# Altium schematic sheet Sheet4.SchDoc
size A; SheetNumber: 2; SheetTotal: 4
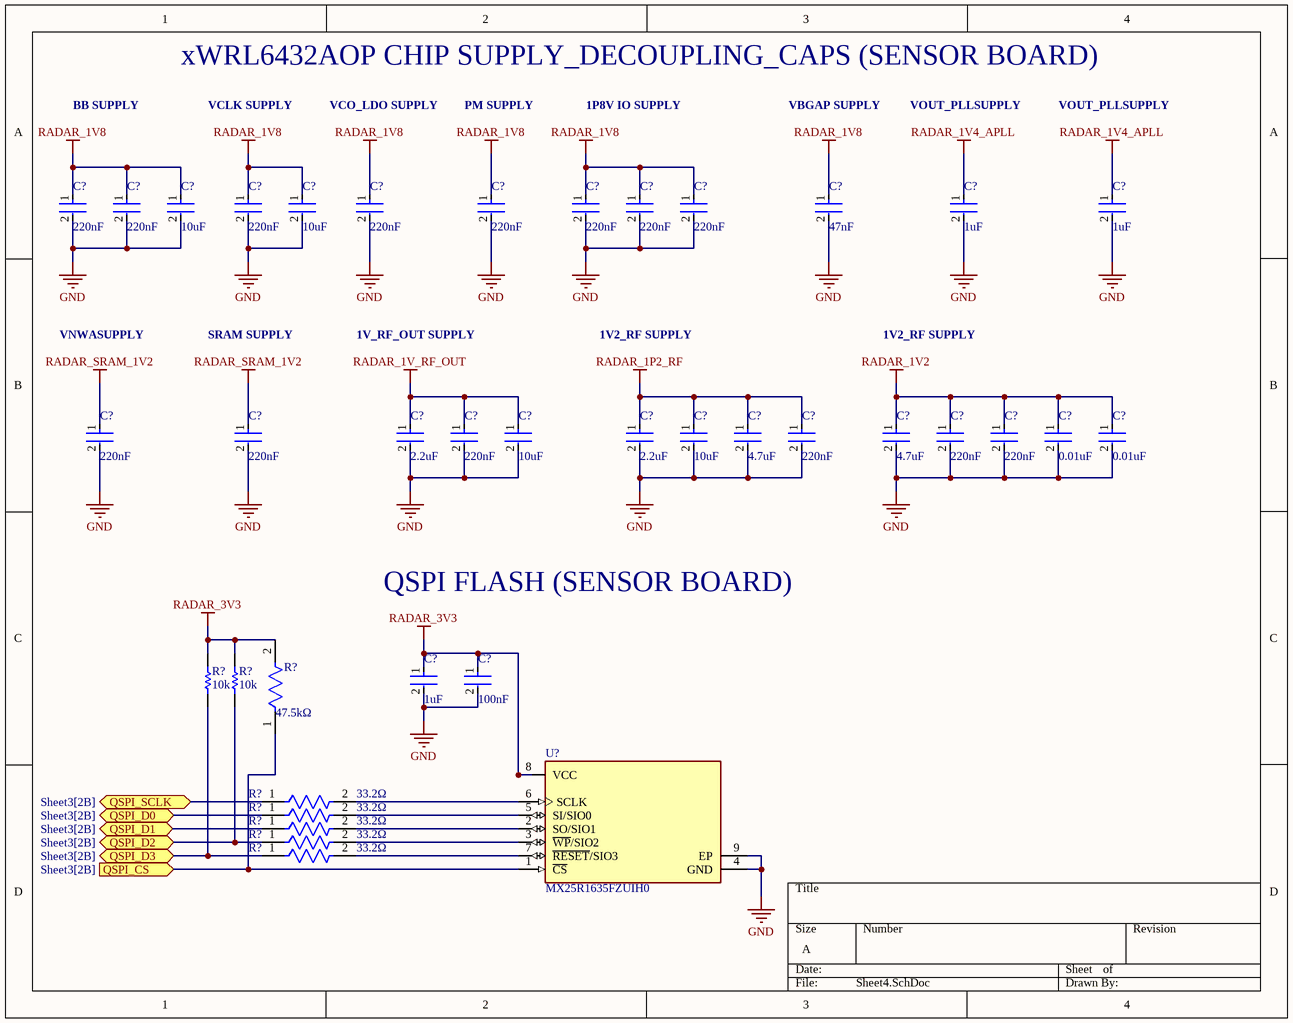
[diagram p0: Sheet4.SchDoc]

## Parts
(Parts that share a designator on the sheet are numbered #1, #2 ... from top to bottom, then left to right.)
C?#1  Capacitance: 220nF  [FP-CL549-IPC_C]  (hidden comment: CL05B224KO5NNNC)
C?#2  Capacitance: 220nF  [FP-CL549-IPC_C]  (hidden comment: CL05B224KO5NNNC)
C?#3  Capacitance: 10uF  [FP-GRM188-0_2-MFG]  (hidden comment: GRM188C81A106MA73D)
C?#4  Capacitance: 220nF  [FP-CL549-IPC_C]  (hidden comment: CL05B224KO5NNNC)
C?#5  Capacitance: 10uF  [FP-GRM188-0_2-MFG]  (hidden comment: GRM188C81A106MA73D)
C?#6  Capacitance: 220nF  [FP-CL549-IPC_C]  (hidden comment: CL05B224KO5NNNC)
C?#7  Capacitance: 220nF  [FP-CL549-IPC_C]  (hidden comment: CL05B224KO5NNNC)
C?#8  Capacitance: 220nF  [FP-CL549-IPC_C]  (hidden comment: CL05B224KO5NNNC)
C?#9  Capacitance: 220nF  [FP-CL549-IPC_C]  (hidden comment: CL05B224KO5NNNC)
C?#10  Capacitance: 220nF  [FP-CL549-IPC_C]  (hidden comment: CL05B224KO5NNNC)
C?#11  Capacitance: 47nF  [FP-C1005-050-0_05-IPC_C]  (hidden comment: C1005X7R1H473K050BB)
C?#12  Capacitance: 1uF  [FP-GRM155-0_05-IPC_C]  (hidden comment: GRM155C80J105KA12D)
C?#13  Capacitance: 1uF  [FP-GRM155-0_05-IPC_C]  (hidden comment: GRM155C80J105KA12D)
C?#14  Capacitance: 220nF  [FP-CL549-IPC_C]  (hidden comment: CL05B224KO5NNNC)
C?#15  Capacitance: 220nF  [FP-CL549-IPC_C]  (hidden comment: CL05B224KO5NNNC)
C?#16  Capacitance: 2.2uF  [FP-GRM155-0_2-MFG]  (hidden comment: GRM155C81C225KE11D)
C?#17  Capacitance: 220nF  [FP-CL549-IPC_C]  (hidden comment: CL05B224KO5NNNC)
C?#18  Capacitance: 10uF  [FP-GRM188-0_2-MFG]  (hidden comment: GRM188C81A106MA73D)
C?#19  Capacitance: 2.2uF  [FP-GRM155-0_2-MFG]  (hidden comment: GRM155C81C225KE11D)
C?#20  Capacitance: 10uF  [FP-GRM188-0_2-MFG]  (hidden comment: GRM188C81A106MA73D)
C?#21  Capacitance: 4.7uF  [FP-GRM21B-0_15-IPC_C]  (hidden comment: GRM21BR71C475KE51L)
C?#22  Capacitance: 220nF  [FP-CL549-IPC_C]  (hidden comment: CL05B224KO5NNNC)
C?#23  Capacitance: 4.7uF  [FP-GRM21B-0_15-IPC_C]  (hidden comment: GRM21BR71C475KE51L)
C?#24  Capacitance: 220nF  [FP-CL549-IPC_C]  (hidden comment: CL05B224KO5NNNC)
C?#25  Capacitance: 220nF  [FP-CL549-IPC_C]  (hidden comment: CL05B224KO5NNNC)
C?#26  value 0.01uF  [FP-C0402-BB-MFG]  (hidden comment: C0402C103K4RACTU)
C?#27  value 0.01uF  [FP-C0402-BB-MFG]  (hidden comment: C0402C103K4RACTU)
C?#28  Capacitance: 1uF  [FP-GRM155-0_05-IPC_C]  (hidden comment: GRM155C80J105KA12D)
C?#29  Capacitance: 100nF  [FP-C1005-050-IPC_C]  (hidden comment: C1005X7R1H104K050BE)
R?#1  10k  [RESC1005X40X25LL05T10]
R?#2  10k  [RESC1005X40X25LL05T10]
R?#3  Resistance: 47.5kΩ  [FP-RC0402-0_4-MFG]  (hidden comment: RC0402FR-1047K5L)
R?#4  Resistance: 33.2Ω  [FP-RT0402-0_35-MFG]  (hidden comment: RT0402FRE0733R2L)
R?#5  Resistance: 33.2Ω  [FP-RT0402-0_35-MFG]  (hidden comment: RT0402FRE0733R2L)
R?#6  Resistance: 33.2Ω  [FP-RT0402-0_35-MFG]  (hidden comment: RT0402FRE0733R2L)
R?#7  Resistance: 33.2Ω  [FP-RT0402-0_35-MFG]  (hidden comment: RT0402FRE0733R2L)
R?#8  Resistance: 33.2Ω  [FP-RT0402-0_35-MFG]  (hidden comment: RT0402FRE0733R2L)
U?  MX25R1635FZUIH0  [FP-USON-8-2x3mm-MFG]

## Ports
QSPI_CS (in, see Sheet3[2B]), QSPI_D0 (bidir, see Sheet3[2B]), QSPI_D1 (bidir, see Sheet3[2B]), QSPI_D2 (bidir, see Sheet3[2B]), QSPI_D3 (bidir, see Sheet3[2B]), QSPI_SCLK (bidir, see Sheet3[2B])

## Nets
GND: C?#1.2 C?#2.2 C?#3.2 C?#4.2 C?#5.2 C?#6.2 C?#7.2 C?#8.2 C?#9.2 C?#10.2 C?#11.2 C?#12.2 C?#13.2 C?#14.2 C?#15.2 C?#16.2 C?#17.2 C?#18.2 C?#19.2 C?#20.2 C?#21.2 C?#22.2 C?#23.2 C?#24.2 C?#25.2 C?#26.2 C?#27.2 C?#28.2 C?#29.2 U?.4(GND) U?.9(EP)
RADAR_1P2_RF: C?#19.1 C?#20.1 C?#21.1 C?#22.1
RADAR_1V2: C?#23.1 C?#24.1 C?#25.1 C?#26.1 C?#27.1
RADAR_1V4_APLL: C?#12.1 C?#13.1
RADAR_1V8: C?#1.1 C?#2.1 C?#3.1 C?#4.1 C?#5.1 C?#6.1 C?#7.1 C?#8.1 C?#9.1 C?#10.1 C?#11.1
RADAR_1V_RF_OUT: C?#16.1 C?#17.1 C?#18.1
RADAR_3V3: C?#28.1 C?#29.1 R?#1.2 R?#2.2 R?#3.2 U?.8(VCC)
RADAR_SRAM_1V2: C?#14.1 C?#15.1
QSPI_CS: R?#3.1 U?.1(~{CS}) ; port QSPI_CS
QSPI_D0: R?#5.1 ; port QSPI_D0
QSPI_D1: R?#6.1 ; port QSPI_D1
QSPI_D2: R?#2.1 R?#7.1 ; port QSPI_D2
QSPI_D3: R?#1.1 R?#8.1 ; port QSPI_D3
QSPI_SCLK: R?#4.1 ; port QSPI_SCLK
NetR?#4_2: R?#4.2 U?.6(SCLK)
NetR?#5_2: R?#5.2 U?.5(SI/SIO0)
NetR?#6_2: R?#6.2 U?.2(SO/SIO1)
NetR?#7_2: R?#7.2 U?.3(~{WP}/SIO2)
NetR?#8_2: R?#8.2 U?.7(~{RESET}/SIO3)

## Notes on the sheet
- xWRL6432AOP CHIP SUPPLY_DECOUPLING_CAPS (SENSOR BOARD)
- BB SUPPLY
- VCLK SUPPLY
- VCO_LDO SUPPLY
- PM SUPPLY
- 1P8V IO SUPPLY
- VBGAP SUPPLY
- VOUT_PLLSUPPLY
- VNWASUPPLY
- SRAM SUPPLY
- 1V_RF_OUT SUPPLY
- 1V2_RF SUPPLY
- QSPI FLASH (SENSOR BOARD)

## Library data of the parts
C?#1 C?#2 C?#4 C?#6-C?#10 C?#14 C?#15 C?#17 C?#22 C?#24 C?#25 = CMP-13271-002972-1: Cap Ceramic 220nF 16V X7R ±10% SMD 0402 +125°C Paper T/R; Length: 1mm; Case Code (Metric): 1005; Dielectric: X7R; Thickness: 0.022inch; Packaging: Tape and Reel; Width: 0.02inch; Voltage Rating: 16V; Max Operating Temperature: 125°C; Tolerance: 10%; Depth: 0.5mm; Radiation Hardening: No; Case Code (Imperial): 0402; Height: 0.5mm; Package Quantity: 1; Mount: Surface Mount; Case/Package: 0402; Min Operating Temperature: -55°C
C?#3 C?#5 C?#18 C?#20 = CMP-06035-002932-1: Chip Multilayer Ceramic Capacitors for General Purpose, 0603, 10uF, X6S, 22%, 20%, 10V; Case Code (Metric): 1608; Max Operating Temperature: 105°C; Voltage Rating (DC): 10V; Thickness: 0.031inch; Width: 0.031inch; Dielectric: X6S; Lead Free: Lead Free; REACH SVHC: No SVHC; Case/Package: 0603; Length: 0.063inch; Min Operating Temperature: -55°C; Package Quantity: 4000; Voltage Rating: 10V; Tolerance: 20%; Packaging: Cut Tape; Material: Ceramic; Mount: Surface Mount; Case Code (Imperial): 0603; Height: 0.8mm
C?#11 = CMP-2000-06006-2: Multilayer Ceramic Capacitors 47nF ±10% 50V X7R SMD 0402; Dissipation Factor: 5%; Weight: 2.3E-05oz; Max Operating Temperature: 125°C; Package Quantity: 1; Width: 0.02inch; Min Operating Temperature: -55°C; Length: 1mm; Dielectric: X7R; Voltage Rating: 50V; Number of Pins: 2; Lead Free: Lead Free; Voltage: 50V; Dielectric Material: Ceramic; Height: 0.5mm; Case Code (Metric): 1005; Voltage Rating (DC): 50V; Construction: Flat; Termination: SMD/SMT; Case Code (Imperial): 0402; Depth: 0.5mm; Packaging: Tape and Reel; Mount: Surface Mount; Series: C; RoHS Compliant: Yes; Tolerance: 10%; Case/Package: 0402; Thickness: 0.022inch; Radiation Hardening: No; Resistor Type: Ceramic; REACH SVHC: No SVHC
C?#12 C?#13 C?#28 = CMP-06035-011876-1: Chip Multilayer Ceramic Capacitors for General Purpose, 0402, 1.0uF, X6S, 22%, 10%, 6.3V; Dielectric: X6S; Width: 500um; Length: 1mm; Thickness: 500um; Tolerance: 10%; Voltage Rating (DC): 6.3V
C?#16 C?#19 = CMP-06035-059778-1: Chip Multilayer Ceramic Capacitors for General Purpose, 0402, 2.2uF, X6S, 22%, 10%, 16V; Material: Ceramic; Voltage Rating: 16V; Case/Package: 0402; Tolerance: 10%; Packaging: Tape and Reel; Mount: Surface Mount; Min Operating Temperature: -55°C; Height: 0.3mm; Thickness: 0.022inch; Voltage Rating (DC): 16V; Max Operating Temperature: 105°C; Length: 0.039inch; Width: 0.02inch
C?#21 C?#23 = CMP-06035-004324-1: Chip Multilayer Ceramic Capacitors for General Purpose, 0805, 4.7uF, X7R, 15%, 10%, 16V; Case/Package: 0805; Width: 1.25mm; Tolerance: 10%; Dielectric: X7R; Thickness: 1.25mm; Voltage Rating (DC): 16V; Length: 2mm
C?#26 C?#27 = CMP-2008-03072-2: CAP CER 10000PF 16V X7R 0402; Manufacturer: Kemet; Tolerance: 0.1; Material: Ceramic; Capacitance: 10,000 pF; Temperature Coefficient: 15%; Package: C0402-BB; Height: 0.55mm; Temperature Range Low: -55°C; Lead Free: Yes; Mouser Description: Capacitor; Ceramic; Cap; .010uF; Tol 10%; SMT; Vol-Rtg 16V; X7R; Tape and Reel; RoHS: TRUE; Device Class L3: Ceramic Capacitors; Voltage Rating: 16 V; Automotive: No; Temperature: -55°C to +125°C; Digikey Description: CAP CER 10000PF 16V X7R 0402; Temperature Characteristic: X7R; Temperature Range High: +125°C; Category: Cap; Ipc Land Pattern Name: CAPC10050X50; ComponentLink2URL: https://content.kemet.com/datasheets/KEM_C1002_X7R_SMD.pdf; Manufacturer Part Number: C0402C103K4RACTU; Octopart: https://octopart.com/c0402c103k4ractu-kemet-130896; ComponentLink2Description: Datasheet; Device Class L1: Passive Components; Device Class L2: Capacitors
C?#29 = CMP-08246-004330-1: CAP CER 0.1UF 50V X7R 0402; Tolerance: 10%; Max Operating Temperature: 125°C; Min Operating Temperature: -55°C; Width: 0.02inch; Case/Package: 0402; Case Code (Metric): 1005; Packaging: Tape and Reel; Length: 0.039inch; Features: Soft Termination; Thickness: 0.024inch; Voltage Rating: 50V; RoHS Compliant: Yes; Case Code (Imperial): 0402; Mount: Surface Mount
R?#1 R?#2 = CMP-2002-07353-1: Part Number: RC0402FR-0710KL; Manufacturer: Yageo / Phycomp
R?#3 = CMP-00621-30511908-1: RC0402FR-1047K5L General Purpose Chip Resistor Thick Film 0402 47.5kOhm 1% Paper T/R; RoHS: Non-Compliant; NexarPartId: 30511908; Packaging: Tape & Reel; Tolerance: 1%; Case/Package: 0402
R?#4-R?#8 = CMP-2002-03033-3: NexarPartId: 1272564; Max Power Dissipation: 63mW; Voltage Rating: 50V; Temperature Coefficient: 50ppm/°C; Tolerance: 1%; Packaging: Tape & Reel (TR); Radiation Hardening: No; Military Standard: Not; Contact Plating: Tin; Case Code (Metric): 0402; Max Operating Temperature: 125°C; Height: 350µm; Lead Free: Lead Free; Case/Package: 0402; Width: 508µm; Length: 990.6µm; RoHS: Compliant; Number of Terminations: 2; Voltage Rating (DC): 50V; Min Operating Temperature: -55°C; Power Rating: 63mW; Depth: 500µm; Composition: Thin Film
U? = CMP-105207-000004-1: IC FLASH 16M SPI 80MHZ 8USON; Packaging: Tape and Reel; Max Operating Temperature: 85°C; Memory Type: FLASH; Lead Free: Lead Free; Interface: SPI; Min Operating Temperature: -40°C; Frequency: 80MHz